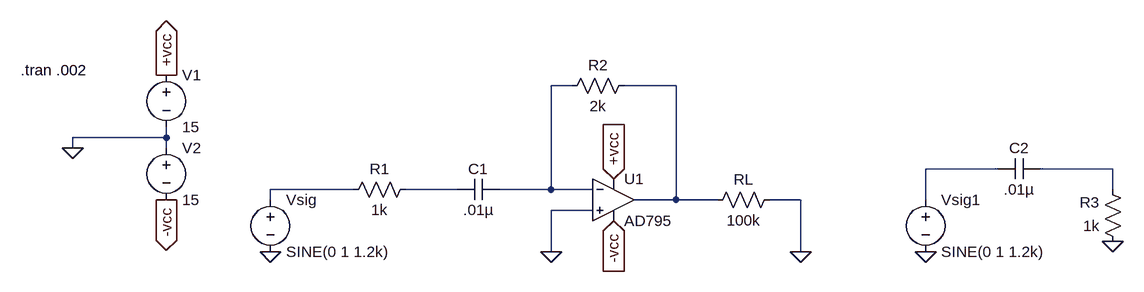
[diagram p0: schematic FILTRO - Passa_Alta.asc]
FILTRO - Passa_Alta.asc, the LTspice schematic file:
Version 4
SHEET 1 1000 680
WIRE 112 0 80 0
WIRE 272 0 192 0
WIRE -512 80 -512 64
WIRE -512 80 -656 80
WIRE -656 96 -656 80
WIRE -512 96 -512 80
WIRE 768 128 656 128
WIRE 944 128 832 128
WIRE -224 160 -352 160
WIRE -64 160 -144 160
WIRE 80 160 80 0
WIRE 80 160 0 160
WIRE 144 160 80 160
WIRE 944 160 944 128
WIRE -352 176 -352 160
WIRE 272 176 272 0
WIRE 272 176 208 176
WIRE 336 176 272 176
WIRE 464 176 416 176
WIRE 656 176 656 128
WIRE 144 192 80 192
WIRE 80 256 80 192
WIRE 464 256 464 176
FLAG -656 96 0
FLAG -512 -16 +vcc
IOPIN -512 -16 Out
FLAG -512 176 -vcc
IOPIN -512 176 Out
FLAG 176 144 +vcc
IOPIN 176 144 In
FLAG 176 208 -vcc
IOPIN 176 208 In
FLAG 80 256 0
FLAG -352 256 0
FLAG 464 256 0
FLAG 656 256 0
FLAG 944 240 0
SYMBOL voltage -512 -32 R0
SYMATTR InstName V1
SYMATTR Value 15
SYMBOL voltage -512 80 R0
SYMATTR InstName V2
SYMATTR Value 15
SYMBOL res -128 144 R90
WINDOW 0 0 56 VBottom 2
WINDOW 3 32 56 VTop 2
SYMATTR InstName R1
SYMATTR Value 1k
SYMBOL res 208 -16 R90
WINDOW 0 0 56 VBottom 2
WINDOW 3 32 56 VTop 2
SYMATTR InstName R2
SYMATTR Value 2k
SYMBOL cap 0 144 R90
WINDOW 0 0 32 VBottom 2
WINDOW 3 32 32 VTop 2
SYMATTR InstName C1
SYMATTR Value .01µ
SYMBOL voltage -352 160 R0
WINDOW 123 0 0 Left 2
WINDOW 39 0 0 Left 2
SYMATTR InstName Vsig
SYMATTR Value SINE(0 1 1.2k)
SYMBOL res 432 160 R90
WINDOW 0 0 56 VBottom 2
WINDOW 3 32 56 VTop 2
SYMATTR InstName RL
SYMATTR Value 100k
SYMBOL Opamps\\AD795 176 112 R0
SYMATTR InstName U1
SYMBOL res 960 256 R180
WINDOW 0 36 76 Left 2
WINDOW 3 36 40 Left 2
SYMATTR InstName R3
SYMATTR Value 1k
SYMBOL voltage 656 160 R0
WINDOW 123 0 0 Left 2
WINDOW 39 0 0 Left 2
SYMATTR InstName Vsig1
SYMATTR Value SINE(0 1 1.2k)
SYMBOL cap 832 112 R90
WINDOW 0 0 32 VBottom 2
WINDOW 3 32 32 VTop 2
SYMATTR InstName C2
SYMATTR Value .01µ
TEXT -736 -24 Left 2 !.tran .002

The netlist it stands for:
* FILTRO - Passa_Alta.asc
V1 +vcc 0 15
V2 0 -vcc 15
R1 N006 N005 1k
R2 N002 N001 2k
C1 N001 N006 .01µ
Vsig N005 0 SINE(0 1 1.2k)
RL 0 N002 100k
XU1 0 N001 +vcc -vcc N002 AD795  ; pins In+ In- V+ V- OUT
R3 0 N004 1k
Vsig1 N003 0 SINE(0 1 1.2k)
C2 N004 N003 .01µ
.tran .002
.lib ADI1.lib
.backanno
.end